# Altium project Power distribution system Final design.PrjPcb
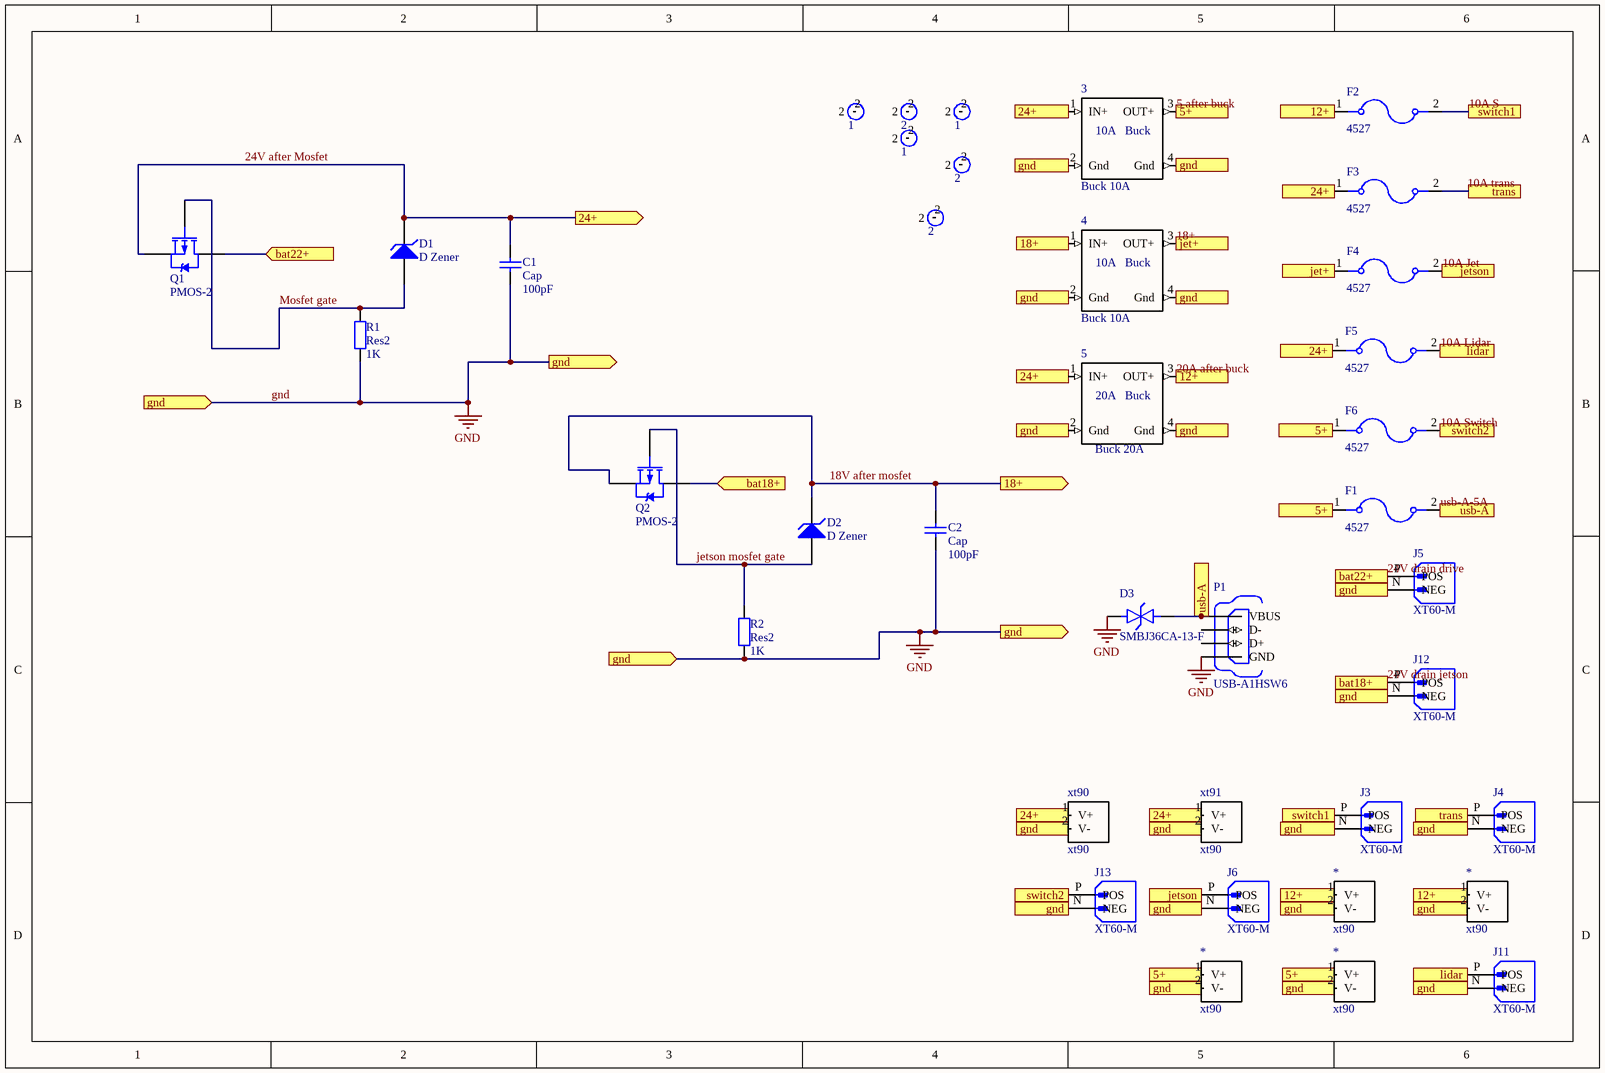
[diagram p0: Power distribution system.SchDoc]
1 sheet, 38 parts. Net scope: flat (ports and power ports of the same name join across sheets).
Board file: Power distribution system.PcbDoc

## Sheet Power distribution system.SchDoc
size 300 x 200 mm; SheetNumber: 1; SheetTotal: 1

### Parts
(Parts that share a designator on the sheet are numbered #1, #2 ... from top to bottom, then left to right.)
1#1  mountinghole_np  [np_mountinghole]  (value not drawn)
1#2  mountinghole_np  [np_mountinghole]  (value not drawn)
1#3  mountinghole_np  [np_mountinghole]  (value not drawn)
2#1  mountinghole_np  [np_mountinghole]  (value not drawn)
2#2  mountinghole_np  [np_mountinghole]  (value not drawn)
2#3  mountinghole_np  [np_mountinghole]  (value not drawn)
3  Buck 10A  [Buck 10A]
4  Buck 10A  [Buck 10A]
5  Buck 20A  [Buck 20A]
*#1  xt90  [xt90]
*#2  xt90  [xt90]
*#3  xt90  [xt90]
*#4  xt90  [xt90]
C1  Cap  value 100pF  [RAD-0.3]
C2  Cap  value 100pF  [RAD-0.3]
D1  D Zener  [DIODE-0.7]
D2  D Zener  [DIODE-0.7]
D3  SMBJ36CA-13-F  [DIONM4336X250N]
F1  4527  [FUSE_4527]
F2  4527  [FUSE_4527]
F3  4527  [FUSE_4527]
F4  4527  [FUSE_4527]
F5  4527  [FUSE_4527]
F6  4527  [FUSE_4527]
J3  XT60-M  [AMASS_XT60-M]
J4  XT60-M  [AMASS_XT60-M]
J5  XT60-M  [AMASS_XT60-M]
J6  XT60-M  [AMASS_XT60-M]
J11  XT60-M  [AMASS_XT60-M]
J12  XT60-M  [AMASS_XT60-M]
J13  XT60-M  [AMASS_XT60-M]
P1  USB-A1HSW6  [OST_USB-A1HSW6]
Q1  PMOS-2  [TO-220AB]
Q2  PMOS-2  [TO-220AB]
R1  Res2  value 1K  [AXIAL-0.4]
R2  Res2  value 1K  [AXIAL-0.4]
xt90  xt90  [xt90]
xt91  xt90  [xt90]

### Ports
5+, 12+, 18+, 18+ (out), 24+, 24+ (out), bat18+, bat18+ (in), bat22+, bat22+ (in), gnd, gnd (in), gnd (out), jet+, jetson, lidar, switch1, switch2, trans, usb-A

### Nets
gnd: 3.2(Gnd) 4.2(Gnd) 4.4(Gnd) 5.2(Gnd) 5.4(Gnd) *#1.2(V-) *#2.2(V-) *#3.2(V-) *#4.2(V-) C1.1 C2.1 D3.1 J3.N(NEG) J4.N(NEG) J5.N(NEG) J6.N(NEG) J11.N(NEG) J12.N(NEG) J13.N(NEG) P1.4(GND) R1.1 R2.1 xt90.2(V-) xt91.2(V-) ; port gnd
5 after buck: 3.3(OUT+) *#3.1(V+) *#4.1(V+) F1.1 F6.1 ; port 5+
10A Jet: F4.2 J6.P(POS) ; port jetson
10A Lidar: F5.2 J11.P(POS) ; port lidar
10A S: F2.2 J3.P(POS) ; port switch1
10A Switch: F6.2 J13.P(POS) ; port switch2
10A trans: F3.2 J4.P(POS) ; port trans
18+: 4.3(OUT+) F4.1 ; port jet+
18V after mosfet: 4.1(IN+) C2.2 D2.2(K) Q2.3(S) ; port 18+
20A after buck: 5.3(OUT+) *#1.1(V+) *#2.1(V+) F2.1 ; port 12+
24V after Mosfet: 3.1(IN+) 5.1(IN+) C1.2 D1.2(K) F3.1 F5.1 Q1.3(S) xt90.1(V+) xt91.1(V+) ; port 24+
24V drain drive: J5.P(POS) Q1.2(D) ; port bat22+
24V drain jetson: J12.P(POS) Q2.2(D) ; port bat18+
jetson mosfet gate: D2.1(A) Q2.1(G) R2.2
Mosfet gate: D1.1(A) Q1.1(G) R1.2
usb-A-5A: D3.2 F1.2 P1.1(VBUS) ; port usb-A

Not connected (* = marked no-connect by the designer): 1#1 2; 1#2 2; 1#3 2; 2#1 2; 2#2 2; 2#3 2; 3 4(Gnd); P1 2(D-) 3(D+)

### Notes on the sheet
- (in symbol Buck 10A) 10A   Buck
- (in symbol Buck 20A) 20A   Buck

### Library data of the parts
3 4 = Buck 10A: pin to pad: 1>20 2>21 3>23 4>22
5 = Buck 20A: pin to pad: 1>24 2>26 3>25 4>27
C1 C2 = Cap: Capacitor; Published: 8-Jun-2000; LatestRevisionDate: 17-Jul-2002; LatestRevisionNote: Re-released for DXP Platform.; PackageReference: RAD-0.3; Publisher: Altium Limited; PackageDescription: Radial Cap, Thru-Hole; 2 Leads; 0.3 in Pin Spacing
D1 D2 = D Zener: Zener Diode; Published: 8-Jun-2000; LatestRevisionDate: 17-Jul-2002; LatestRevisionNote: Re-released for DXP Platform.; PackageReference: DIODE-0.7; Publisher: Altium Limited; PackageDescription: Diode, Thru-Hole; 2 Leads; 0.7 in Pin Spacing
D3 = SMBJ36CA-13-F: SMBJ36CA Series 600 W 36 V Surface Mount Bi-Directional TVS Diode - DO-214AA; Package: None; MP: SMBJ36CA-13-F; Value: *; Availability: Unavailable; Price: None
F1-F6 = 4527: Fuseholder; 5 A; 250 V; Nylon; Base only; Brass, Tin Plate (Contact); Value: *; MP: 4527; Package: None; Availability: Unavailable; Price: None
J3-J6 J11-J13 = XT60-M: Plug; DC supply; XT60; male; PIN: 2; for cable; soldered; 30A; 500V; MF: AMASS; Package: Package; Availability: Not in stock; SnapEDA_Link: https://www.snapeda.com/parts/XT60-M/AMASS/view-part/?ref=snap; Check_prices: https://www.snapeda.com/parts/XT60-M/AMASS/view-part/?ref=eda; MP: XT60-M; Price: None; Value: *
P1 = USB-A1HSW6: USB-A (USB TYPE-A) - Receptacle Connector 4 Position Through Hole, Right Angle; MF: On Shore; Value: *; SnapEDA_Link: https://www.snapeda.com/parts/USB-A1HSW6/On+Shore+Technology+Inc./view-part/?ref=snap; Purchase-URL: https://pricing.snapeda.com/search/part/USB-A1HSW6/?ref=eda; Availability: In Stock; Price: None; Package: None; Check_prices: https://www.snapeda.com/parts/USB-A1HSW6/On+Shore+Technology+Inc./view-part/?ref=eda; MP: USB-A1HSW6
Q1 Q2 = PMOS-2: P-Channel Power MOSFET; Note: Pin 4 not drawn and electrically connected to Pin 2.; Published: 8-Jun-2000; LatestRevisionDate: 17-Jul-2002; LatestRevisionNote: Re-released for DXP Platform.; DatasheetVersion: PD-9.390D; PackageVersion: Feb-1997; PackageReference: TO-220AB; Publisher: Altium Limited; PackageDescription: TO, Thru-Hole, Vertical, Heatsink Mounted; 3 In-Line Leads; Pitch 2.54 mm; ComponentLink1Description: Manufacturer Link; ComponentLink1URL: http://www.irf.com/
R1 R2 = Res2: Resistor; Published: 8-Jun-2000; LatestRevisionDate: 17-Jul-2002; LatestRevisionNote: Re-released for DXP Platform.; PackageReference: AXIAL-0.4; Publisher: Altium Limited; PackageDescription: Axial Device, Thru-Hole; 2 Leads; 0.4 in Pin Spacing